# EAGLE schematic wheatstone_bridge_board (EAGLE 9.6.2)
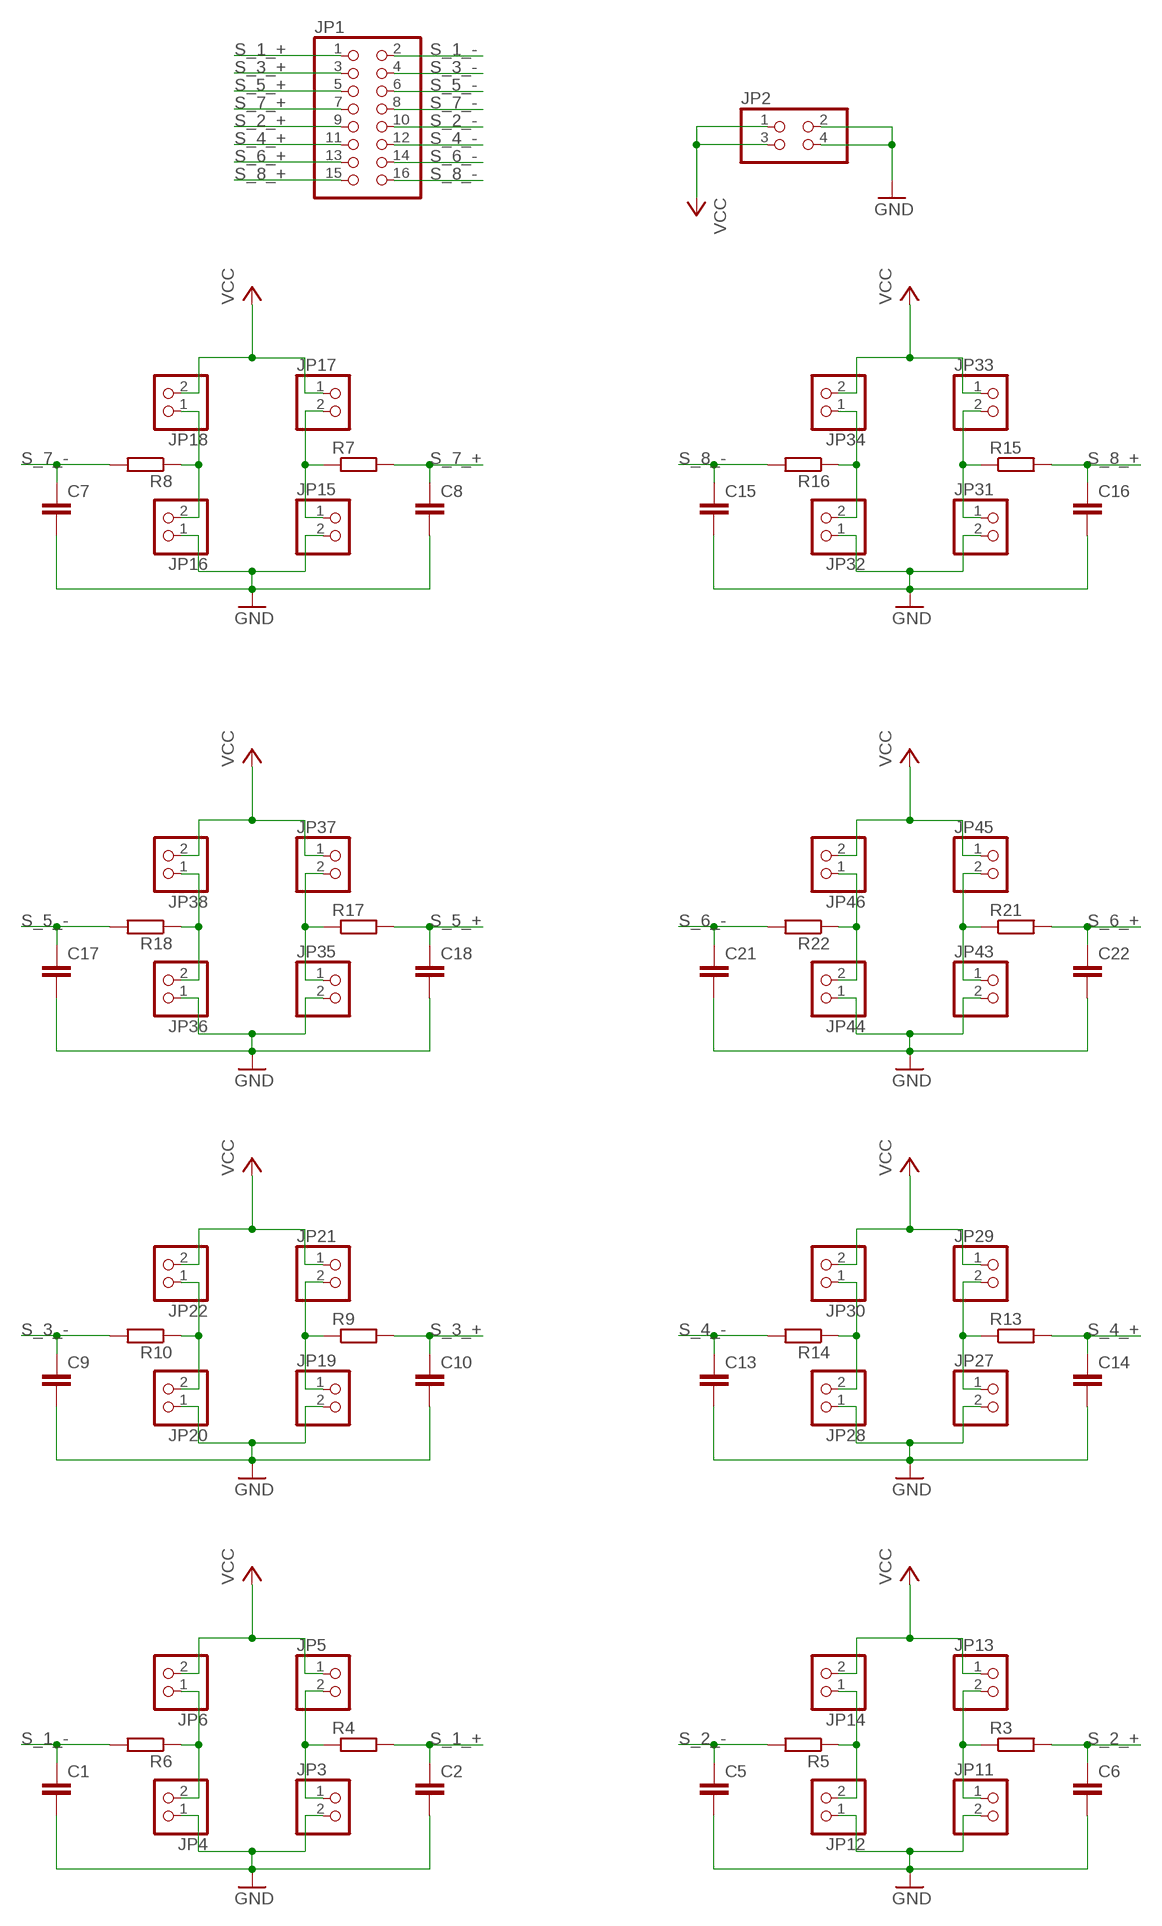
[diagram p0: schematic, sheet 1]

## Parts
C1  C-EU025-050X050  [C025-050X050]
C2  C-EU025-050X050  [C025-050X050]
C5  C-EU025-050X050  [C025-050X050]
C6  C-EU025-050X050  [C025-050X050]
C7  C-EU025-050X050  [C025-050X050]
C8  C-EU025-050X050  [C025-050X050]
C9  C-EU025-050X050  [C025-050X050]
C10  C-EU025-050X050  [C025-050X050]
C13  C-EU025-050X050  [C025-050X050]
C14  C-EU025-050X050  [C025-050X050]
C15  C-EU025-050X050  [C025-050X050]
C16  C-EU025-050X050  [C025-050X050]
C17  C-EU025-050X050  [C025-050X050]
C18  C-EU025-050X050  [C025-050X050]
C21  C-EU025-050X050  [C025-050X050]
C22  C-EU025-050X050  [C025-050X050]
JP1  PINHD-2X8/90  [2X08/90]
JP2  PINHD-2X2/90  [2X02/90]
JP3  PINHD-1X2  [1X02]
JP4  PINHD-1X2  [1X02]
JP5  PINHD-1X2  [1X02]
JP6  PINHD-1X2  [1X02]
JP11  PINHD-1X2  [1X02]
JP12  PINHD-1X2  [1X02]
JP13  PINHD-1X2  [1X02]
JP14  PINHD-1X2  [1X02]
JP15  PINHD-1X2  [1X02]
JP16  PINHD-1X2  [1X02]
JP17  PINHD-1X2  [1X02]
JP18  PINHD-1X2  [1X02]
JP19  PINHD-1X2  [1X02]
JP20  PINHD-1X2  [1X02]
JP21  PINHD-1X2  [1X02]
JP22  PINHD-1X2  [1X02]
JP27  PINHD-1X2  [1X02]
JP28  PINHD-1X2  [1X02]
JP29  PINHD-1X2  [1X02]
JP30  PINHD-1X2  [1X02]
JP31  PINHD-1X2  [1X02]
JP32  PINHD-1X2  [1X02]
JP33  PINHD-1X2  [1X02]
JP34  PINHD-1X2  [1X02]
JP35  PINHD-1X2  [1X02]
JP36  PINHD-1X2  [1X02]
JP37  PINHD-1X2  [1X02]
JP38  PINHD-1X2  [1X02]
JP43  PINHD-1X2  [1X02]
JP44  PINHD-1X2  [1X02]
JP45  PINHD-1X2  [1X02]
JP46  PINHD-1X2  [1X02]
R3  R-EU_R0603  [R0603]
R4  R-EU_R0603  [R0603]
R5  R-EU_R0603  [R0603]
R6  R-EU_R0603  [R0603]
R7  R-EU_R0603  [R0603]
R8  R-EU_R0603  [R0603]
R9  R-EU_R0603  [R0603]
R10  R-EU_R0603  [R0603]
R13  R-EU_R0603  [R0603]
R14  R-EU_R0603  [R0603]
R15  R-EU_R0603  [R0603]
R16  R-EU_R0603  [R0603]
R17  R-EU_R0603  [R0603]
R18  R-EU_R0603  [R0603]
R21  R-EU_R0603  [R0603]
R22  R-EU_R0603  [R0603]

## Nets
GND: C1.2 C2.2 C5.2 C6.2 C7.2 C8.2 C9.2 C10.2 C13.2 C14.2 C15.2 C16.2 C17.2 C18.2 C21.2 C22.2 JP2.2 JP2.4 JP3.2 JP4.1 JP11.2 JP12.1 JP15.2 JP16.1 JP19.2 JP20.1 JP27.2 JP28.1 JP31.2 JP32.1 JP35.2 JP36.1 JP43.2 JP44.1
N$1: JP4.2 JP6.1 R6.1
N$2: JP3.1 JP5.2 R4.1
N$5: JP12.2 JP14.1 R5.1
N$6: JP11.1 JP13.2 R3.1
N$7: JP16.2 JP18.1 R8.1
N$8: JP15.1 JP17.2 R7.1
N$9: JP20.2 JP22.1 R10.1
N$10: JP19.1 JP21.2 R9.1
N$13: JP28.2 JP30.1 R14.1
N$14: JP27.1 JP29.2 R13.1
N$15: JP32.2 JP34.1 R16.1
N$16: JP31.1 JP33.2 R15.1
N$17: JP36.2 JP38.1 R18.1
N$18: JP35.1 JP37.2 R17.1
N$21: JP44.2 JP46.1 R22.1
N$22: JP43.1 JP45.2 R21.1
S_1_+: C2.1 JP1.1 R4.2
S_1_-: C1.1 JP1.2 R6.2
S_2_+: C6.1 JP1.9 R3.2
S_2_-: C5.1 JP1.10 R5.2
S_3_+: C10.1 JP1.3 R9.2
S_3_-: C9.1 JP1.4 R10.2
S_4_+: C14.1 JP1.11 R13.2
S_4_-: C13.1 JP1.12 R14.2
S_5_+: C18.1 JP1.5 R17.2
S_5_-: C17.1 JP1.6 R18.2
S_6_+: C22.1 JP1.13 R21.2
S_6_-: C21.1 JP1.14 R22.2
S_7_+: C8.1 JP1.7 R7.2
S_7_-: C7.1 JP1.8 R8.2
S_8_+: C16.1 JP1.15 R15.2
S_8_-: C15.1 JP1.16 R16.2
VCC: JP2.1 JP2.3 JP5.1 JP6.2 JP13.1 JP14.2 JP17.1 JP18.2 JP21.1 JP22.2 JP29.1 JP30.2 JP33.1 JP34.2 JP37.1 JP38.2 JP45.1 JP46.2

## Library data of the parts
C1 C2 C5-C10 C13-C18 C21 C22 = resistor:C-EU: CAPACITOR, European symbol
JP1 = pinhead:PINHD-2X8: PIN HEADER
JP2 = pinhead:PINHD-2X2: PIN HEADER
JP3-JP6 JP11-JP22 JP27-JP38 JP43-JP46 = pinhead:PINHD-1X2: PIN HEADER
R3-R10 R13-R18 R21 R22 = resistor:R-EU_: RESISTOR, European symbol